# EAGLE design musicbox-breakouts-02 (EAGLE 9.6.2)
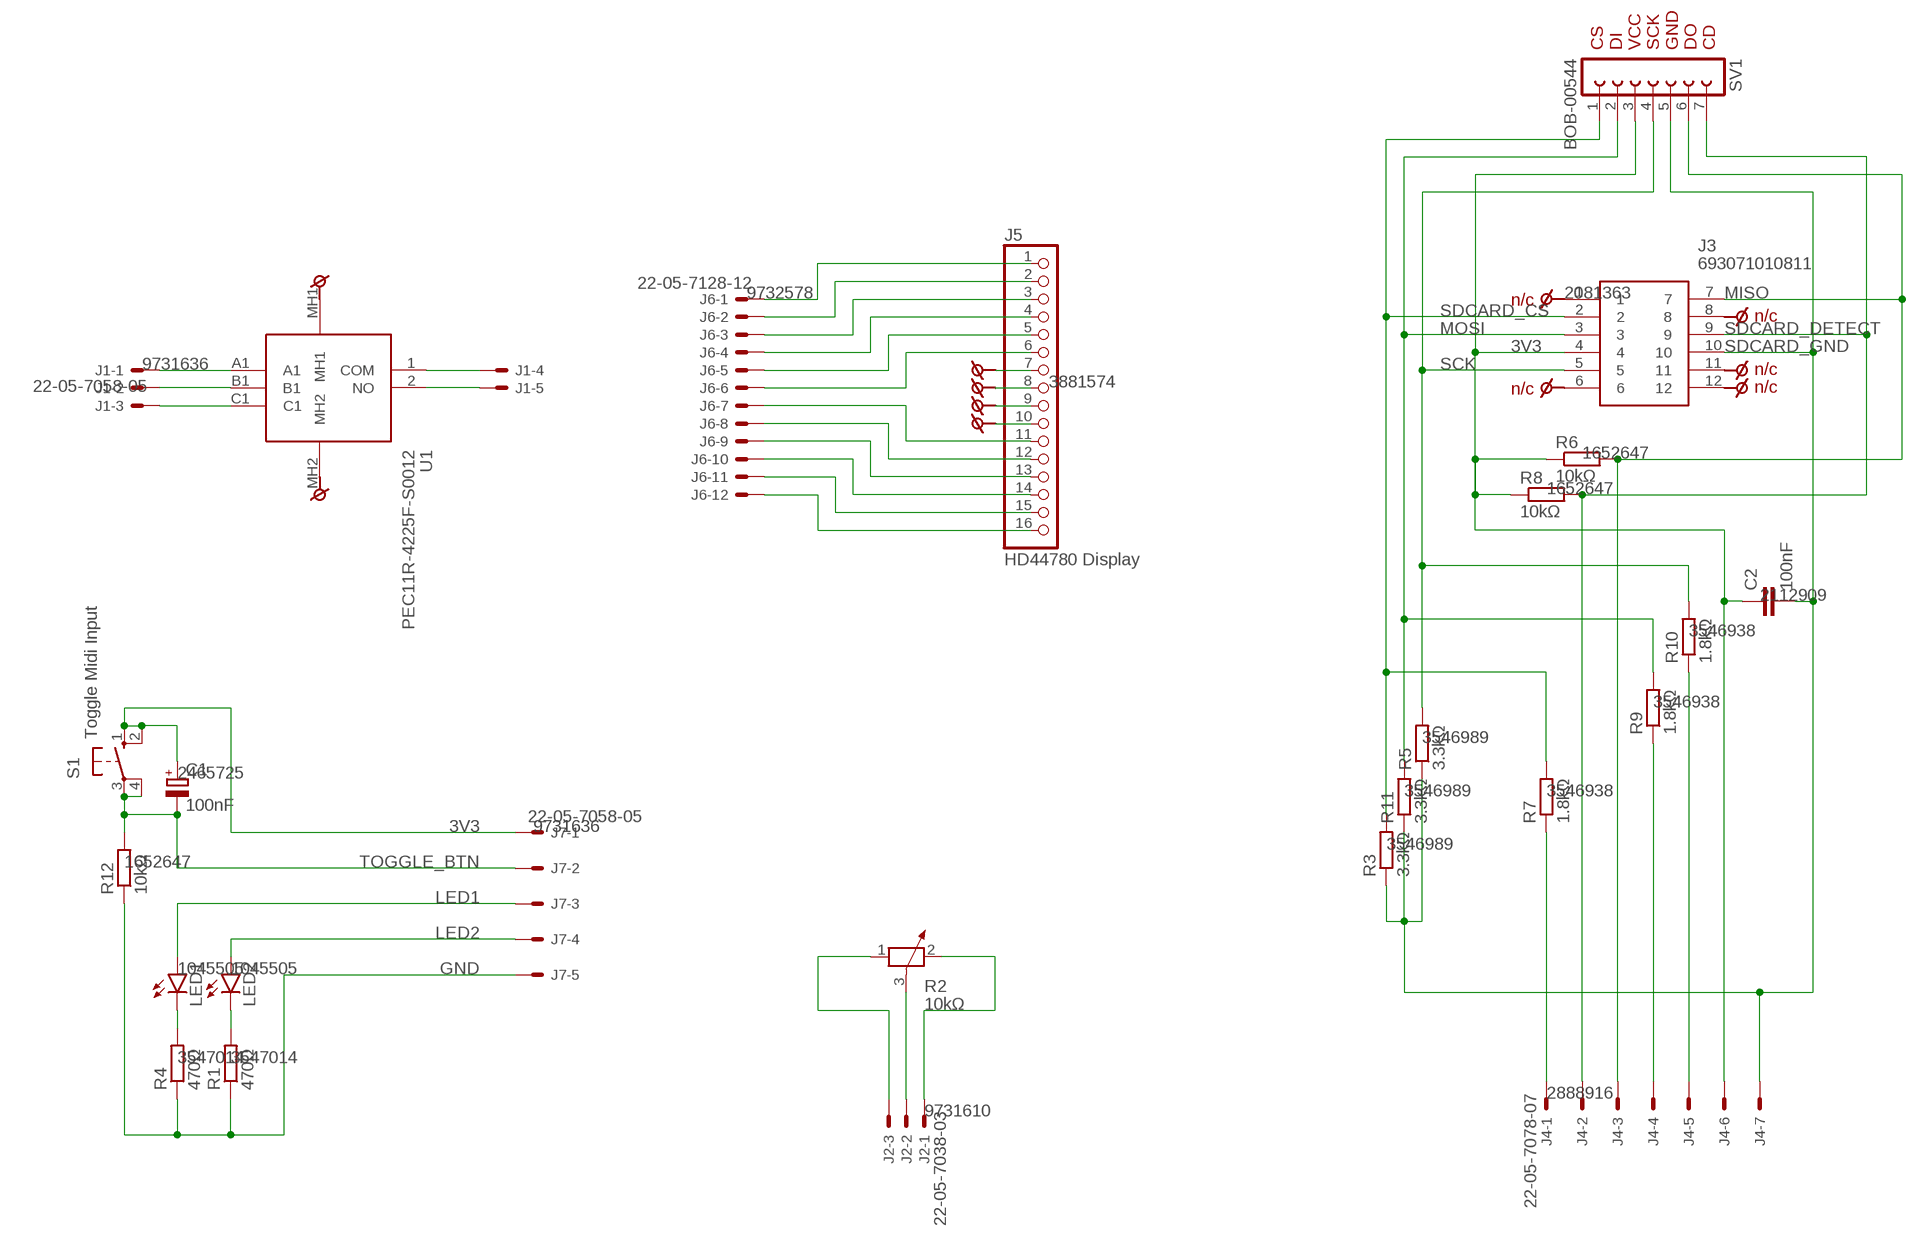
[diagram p0: schematic, sheet 1]

## Parts
C1  100nF  CPOL-EUE1.8-4  [E1,8-4]
C2  100nF  C-EU025-025X050  [C025-025X050]
J1  22-05-7058-05  [7395-05]
J2  22-05-7038-03  [7395-03]
J3  693071010811  [693071010811]
J4  22-05-7078-07  [7395-07]
J5  HD44780 Display  PINHD-1X16  [1X16]
J6  22-05-7128-12  [7395-12]
J7  22-05-7058-05  [7395-05]
LED1  LED3MM  [LED3MM]
LED2  LED3MM  [LED3MM]
R1  470Ω  R-EU_0207/7  [0207/7]
R2  10kΩ  POTENTIOMETER_PT-10  [PT-10]
R3  3.3kΩ  R-EU_0207/7  [0207/7]
R4  470Ω  R-EU_0207/7  [0207/7]
R5  3.3kΩ  R-EU_0207/7  [0207/7]
R6  10kΩ  R-EU_0207/7  [0207/7]
R7  1.8kΩ  R-EU_0207/7  [0207/7]
R8  10kΩ  R-EU_0207/7  [0207/7]
R9  1.8kΩ  R-EU_0207/7  [0207/7]
R10  1.8kΩ  R-EU_0207/7  [0207/7]
R11  3.3kΩ  R-EU_0207/7  [0207/7]
R12  10kΩ  R-EU_0207/7  [0207/7]
S1  Toggle Midi Input  10-XX  [B3F-10XX]
SV1  BOB-00544  FE07-1  [FE07]
U1  PEC11R-4225F-S0012  [PEC11R4225FS0012]
U$1  N/C-ALT  (no package)
U$2  N/C-ALT  (no package)
U$31  N/C-ALT  (no package)
U$32  N/C-ALT  (no package)
U$33  N/C-ALT  (no package)
U$34  N/C-ALT  (no package)
U$68  N/C-ALT-WITH-TEXT  (no package)
U$72  N/C-ALT-WITH-TEXT  (no package)
U$73  N/C-ALT-WITH-TEXT  (no package)
U$74  N/C-ALT-WITH-TEXT  (no package)
U$75  N/C-ALT-WITH-TEXT  (no package)

## Nets
3V3: C2.1 J3.4 J4.6 R6.1 R8.1 SV1.3
DISPLAY_1: J5.1 J6.1
MISO: J3.7 J4.3 R6.2 SV1.6
MOSI: J3.3 R9.2 R11.2 SV1.2
N$1: J1.1 U1.A1
N$2: J1.2 U1.B1
N$3: J1.3 U1.C1
N$4: J1.5 U1.2(NO)
N$5: J1.4 U1.1(COM)
N$6: U1.MH1 U$1.P$1
N$7: U1.MH2 U$2.P$1
N$32: J5.2 J6.2
N$33: J5.3 J6.3
N$34: J5.4 J6.4
N$35: J5.5 J6.5
N$36: J5.6 J6.6
N$37: J5.16 J6.12
N$38: J5.15 J6.11
N$39: J5.14 J6.10
N$40: J5.13 J6.9
N$41: J5.12 J6.8
N$42: J5.11 J6.7
N$43: J5.7 U$31.P$1
N$44: J5.8 U$32.P$1
N$45: J5.9 U$33.P$1
N$46: J5.10 U$34.P$1
N$47: C1.- J7.2 R12.2 S1.3(P) S1.4(P1)
N$48: J7.3 LED1.A
N$49: J7.4 LED2.A
N$52: C1.+ J7.1 S1.1(S) S1.2(S1)
N$53: J7.5 R1.1 R4.1 R12.1
N$54: LED1.K(C) R4.2
N$55: LED2.K(C) R1.2
N$56: J2.3 R2.1
N$57: J2.2 R2.3
N$58: J2.1 R2.2
N$66: J4.1 R7.1
N$67: J3.1 U$68.P$1
N$68: J4.5 R10.1
N$69: J4.4 R9.1
N$70: J3.6 U$72.P$1
N$71: J3.8 U$73.P$1
N$72: J3.11 U$74.P$1
N$73: J3.12 U$75.P$1
SCK: J3.5 R5.2 R10.2 SV1.4
SDCARD_CS: J3.2 R3.2 R7.2 SV1.1
SDCARD_DETECT: J3.9 J4.2 R8.2 SV1.7
SDCARD_GND: C2.2 J3.10 J4.7 R3.1 R5.1 R11.1 SV1.5

## Notes on the sheet
- CS
  DI
  VCC
  SCK
  GND
  DO
  CD
- 3V3
- TOGGLE_BTN
- LED1
- LED2
- GND

## Library data of the parts
C1 = rcl:CPOL-EU: POLARIZED CAPACITOR, European symbol; DIGIKEY_PART_NUMBER: 732-8653-1-ND; FARNELL_PART_NUMBER: 2465725; MANUFACTURER_NAME: Wurth Elektronik; MOUSER_PART_NUMBER: 710-860010672001; SPICEPREFIX: C
C2 = rcl:C-EU: CAPACITOR, European symbol; DIGIKEY_PART_NUMBER: BC5142-ND; FARNELL_PART_NUMBER: 2112909; MANUFACTURER_NAME: Vishay / BC Components; MOUSER_PART_NUMBER: 594-K104M15X7RF53L2; SPICEPREFIX: C
J1 J7 = con-molex:22-?-05: CONNECTOR wire to board 2.54 mm (.1 inch) pitch header; DIGIKEY_PART_NUMBER: WM2787-ND; FARNELL_PART_NUMBER: 9731636; MANUFACTURER_NAME: Molex; MF: MOLEX; MOUSER_PART_NUMBER: 538-22-05-7058; OC_FARNELL: unknown; OC_NEWARK: unknown
J2 = con-molex:22-?-03: CONNECTOR wire to board 2.54 mm (.1 inch) pitch header; DIGIKEY_PART_NUMBER: WM2785-ND; FARNELL_PART_NUMBER: 9731610; MANUFACTURER_NAME: Molex; MF: MOLEX; MOUSER_PART_NUMBER: 538-22-05-7038; OC_FARNELL: unknown; OC_NEWARK: unknown
J3 = 693071010811:693071010811: Wurth Elektronik Micro SD Memory Card Connector Source: Datasheet <https://www.we-online.de/katalog/datasheet/693071010811.pdf>; DESCRIPTION: Wurth Elektronik Micro SD Memory Card Connector; DIGIKEY_PART_NUMBER: 732-3819-1-ND; FARNELL_PART_NUMBER: 2081363; HEIGHT: 2.13mm; MANUFACTURER_NAME: Wurth Elektronik; MANUFACTURER_PART_NUMBER: 693071010811; MOUSER_PART_NUMBER: 710-693071010811; MOUSER_PRICE-STOCK: https://www.mouser.co.uk/ProductDetail/Wurth-Elektronik/693071010811?qs=7gQLVZk5cPniDgiow3734g%3D%3D
J4 = con-molex:22-?-07: CONNECTOR wire to board 2.54 mm (.1 inch) pitch header; DIGIKEY_PART_NUMBER: WM17054-ND; FARNELL_PART_NUMBER: 2888916; MANUFACTURER_NAME: Molex; MF: MOLEX; MOUSER_PART_NUMBER: 538-22-05-7078; OC_FARNELL: unknown; OC_NEWARK: unknown
J5 = pinhead:PINHD-1X16: PIN HEADER; DIGIKEY_PART_NUMBER: 68002-116-ND; FARNELL_PART_NUMBER: 3881574; MANUFACTURER_NAME: Amphenol FCI; MOUSER_PART_NUMBER: 649-1012937891601BLF
J6 = con-molex:22-?-12: CONNECTOR wire to board 2.54 mm (.1 inch) pitch header; DIGIKEY_PART_NUMBER: WM4378-ND; FARNELL_PART_NUMBER: 9732578; MANUFACTURER_NAME: Molex; MF: MOLEX; MOUSER_PART_NUMBER: 538-22-05-7128; OC_FARNELL: unknown; OC_NEWARK: unknown
LED1 LED2 = led:LED: LED OSRAM: - CHIPLED LG R971, LG N971, LY N971, LG Q971, LY Q971, LO R971, LY R971 LH N974, LH R974 LS Q976, LO Q976, LY Q976 LO Q996 - Hyper CHIPLED LW Q18S LB Q993, LB Q99A, LB R99A - SideLED LS A670, LO A670, LY A670, LG A670, LP A670 LB A673, LV A673, LT A673, LW A673 LH A674 LY A675 LS A676, LA A676, LO A676, LY A676, LW A676 LS A679, LY A679, LG A679 - Hyper Micro SIDELED® LS Y876, LA Y876, LO Y876, LY Y876 LT Y87S - SmartLED LW L88C, LW L88S LB L89C, LB L89S, LG L890 LS L89K, LO L89K, LY L89K LS L896, LA L896, LO L896, LY L896 - TOPLED LS T670, LO T670, LY T670, LG T670, LP T670 LSG T670, LSP T670, LSY T670, LOP T670, LYG T670 LG T671, LOG T671, LSG T671 LB T673, LV T673, LT T673, LW T673 LH T674 LS T676, LA T676, LO T676, LY T676, LB T676, LH T676, LSB T676, LW T676 LB T67C, LV T67C, LT T67C, LS T67K, LO T67K, LY T67K, LW E67C LS E67B, LA E67B, LO E67B, LY E67B, LB E67C, LV E67C, LT E67C LW T67C LS T679, LY T679, LG T679 LS T770, LO T770, LY T770, LG T770, LP T770 LB T773, LV T773, LT T773, LW T773 LH T774 LS E675, LA E675, LY E675, LS T675 LS T776, LA T776, LO T776, LY T776, LB T776 LHGB T686 LT T68C, LB T68C - Hyper Mini TOPLED® LB M676 - Mini TOPLED Santana® LG M470 LS M47K, LO M47K, LY M47K Source: http://www.osram.convergy.de LUXEON: - LUMILED® LXK2-PW12-R00, LXK2-PW12-S00, LXK2-PW14-U00, LXK2-PW14-V00 LXK2-PM12-R00, LXK2-PM12-S00, LXK2-PM14-U00 LXK2-PE12-Q00, LXK2-PE12-R00, LXK2-PE12-S00, LXK2-PE14-T00, LXK2-PE14-U00 LXK2-PB12-K00, LXK2-PB12-L00, LXK2-PB12-M00, LXK2-PB14-N00, LXK2-PB14-P00, LXK2-PB14-Q00 LXK2-PR12-L00, LXK2-PR12-M00, LXK2-PR14-Q00, LXK2-PR14-R00 LXK2-PD12-Q00, LXK2-PD12-R00, LXK2-PD12-S00 LXK2-PH12-R00, LXK2-PH12-S00 LXK2-PL12-P00, LXK2-PL12-Q00, LXK2-PL12-R00 Source: www.luxeon.com KINGBRIGHT: KA-3528ASYC Source: www.kingbright.com; DIGIKEY_PART_NUMBER: TLLG4401-AS12CT-ND; FARNELL_PART_NUMBER: 1045505; MANUFACTURER_NAME: Vishay Semiconductors; MOUSER_PART_NUMBER: 78-TLLG4401-AS12
R1 R4 = rcl:R-EU_: RESISTOR, European symbol; DIGIKEY_PART_NUMBER: BC3790CT-ND; FARNELL_PART_NUMBER: 3547014; MANUFACTURER_NAME: Vishay / Beyschlag; MOUSER_PART_NUMBER: 594-MBB02070C4700FCT; SPICEPREFIX: R
R2 = rcl:POTENTIOMETER_: Potentiometer; DIGIKEY_PART_NUMBER: 1993-PT10MV10-103A1010-PM-S-ND; MANUFACTURER_NAME: Amphenol Piher; MOUSER_PART_NUMBER: 531-PT10MV1103A11PMS; SPICEMODEL: POT; SPICEPREFIX: X
R3 R5 R11 = rcl:R-EU_: RESISTOR, European symbol; DIGIKEY_PART_NUMBER: BC3743CT-ND; FARNELL_PART_NUMBER: 3546989; MANUFACTURER_NAME: Vishay / Beyschlag; MOUSER_PART_NUMBER: 594-MBB02070C3301FCT; SPICEPREFIX: R
R6 R8 R12 = rcl:R-EU_: RESISTOR, European symbol; DIGIKEY_PART_NUMBER: BC3569CT-ND; FARNELL_PART_NUMBER: 1652647; MANUFACTURER_NAME: Vishay / Beyschlag; MOUSER_PART_NUMBER: 594-MBB02070C1002FCT; SPICEPREFIX: R
R7 R9 R10 = rcl:R-EU_: RESISTOR, European symbol; DIGIKEY_PART_NUMBER: BC3638CT-ND; FARNELL_PART_NUMBER: 3546938; MANUFACTURER_NAME: Vishay / Beyschlag; MOUSER_PART_NUMBER: 594-MBB02070C1801FCT; SPICEPREFIX: R
S1 = switch-omron:10-XX: OMRON SWITCH; DESCRIPTION: Tactile Switch; DIGIKEY_PART_NUMBER: 2223-TS02-66-130-BK-160-LCR-D-ND; MANUFACTURER_NAME: CUI Devices; MOUSER_PART_NUMBER: 179-TS0266130BK160LC; MPN: B3F-1000; OC_FARNELL: 176432; OC_NEWARK: 36M3542; PACKAGE: 6x6x13mm
SV1 = con-lsta:FE07-1: FEMALE HEADER; OC_FARNELL: unknown; OC_NEWARK: unknown
U1 = PEC11R-4225F-S0012:PEC11R-4225F-S0012: Encoders 25mm SHAFT w/SWITCH Source: Datasheet <https://www.bourns.com/docs/product-datasheets/pec11r.pdf?sfvrsn=bb617cbf_11>; DESCRIPTION: Encoders 25mm SHAFT w/SWITCH; DIGIKEY_PART_NUMBER: PEC11R-4225F-S0012-ND; HEIGHT: 31.5mm; MANUFACTURER_NAME: Bourns; MANUFACTURER_PART_NUMBER: PEC11R-4225F-S0012; MOUSER_PART_NUMBER: 652-PEC11R-4225F-S12; MOUSER_PRICE-STOCK: https://www.mouser.co.uk/ProductDetail/Bourns/PEC11R-4225F-S0012?qs=Zq5ylnUbLm4jMN%252BFiPmzDg%3D%3D
U$1 U$2 U$31-U$34 = nc-pin:N/C-ALT: N/C Symbol No Label With Pin-Leg Alternative Symbol; _EXTERNAL_: n/c
U$68 U$72-U$75 = nc-pin:N/C-ALT-WITH-TEXT: N/C Symbol With Label With Pin-Leg Alternative Symbol Slash-Notation; _EXTERNAL_: n/c

## Net classes
0 default: width 0.406 mm
1 pwr: width 0.965 mm, clearance 0.305 mm

## Board
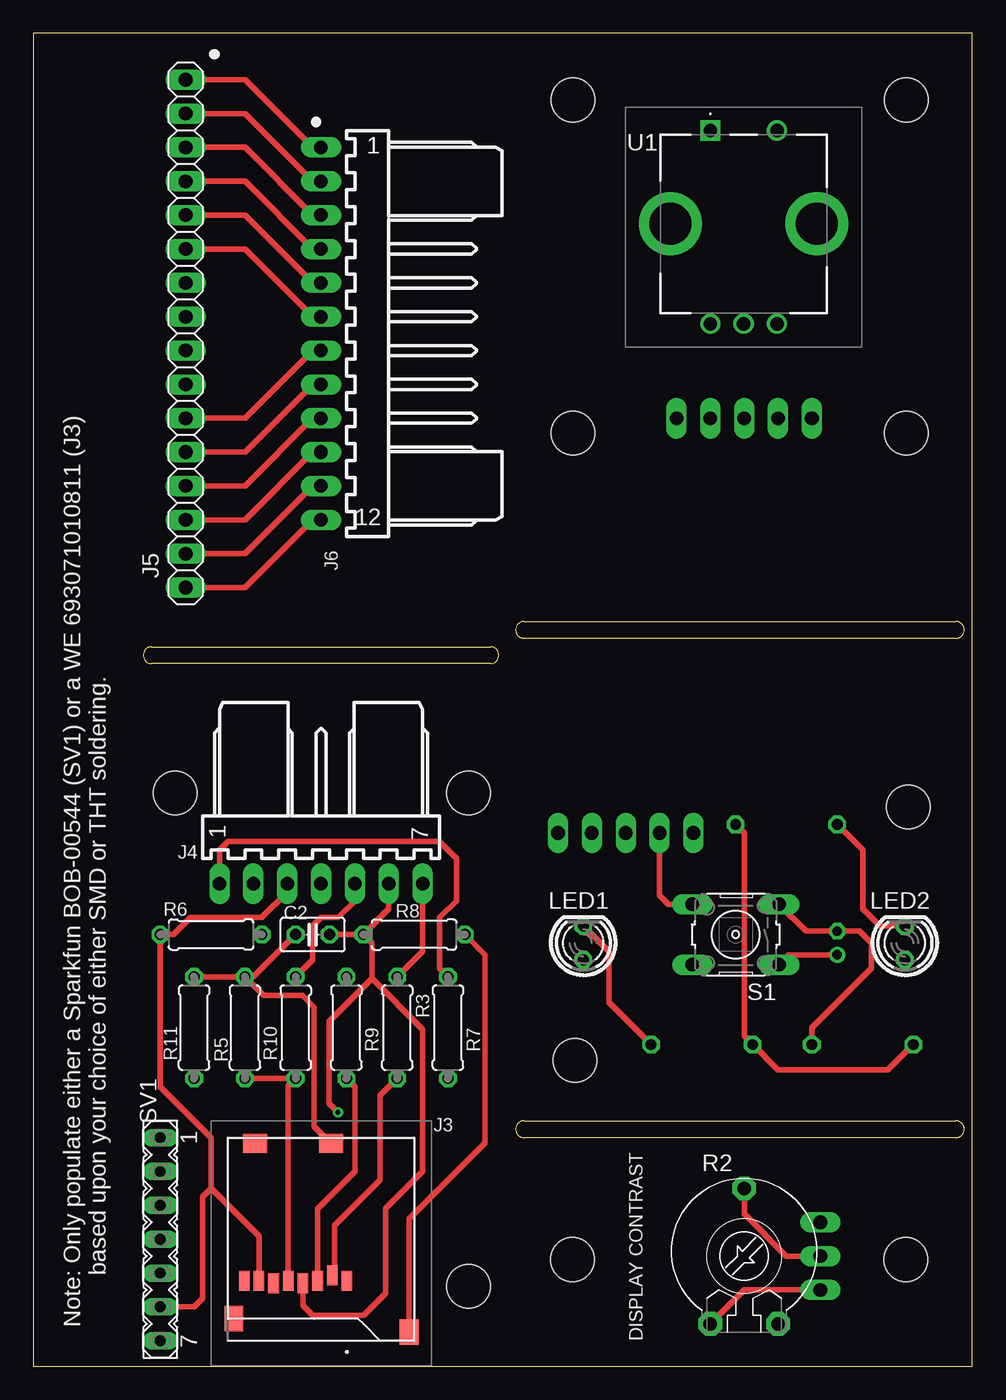
[diagram p1: board, top side]
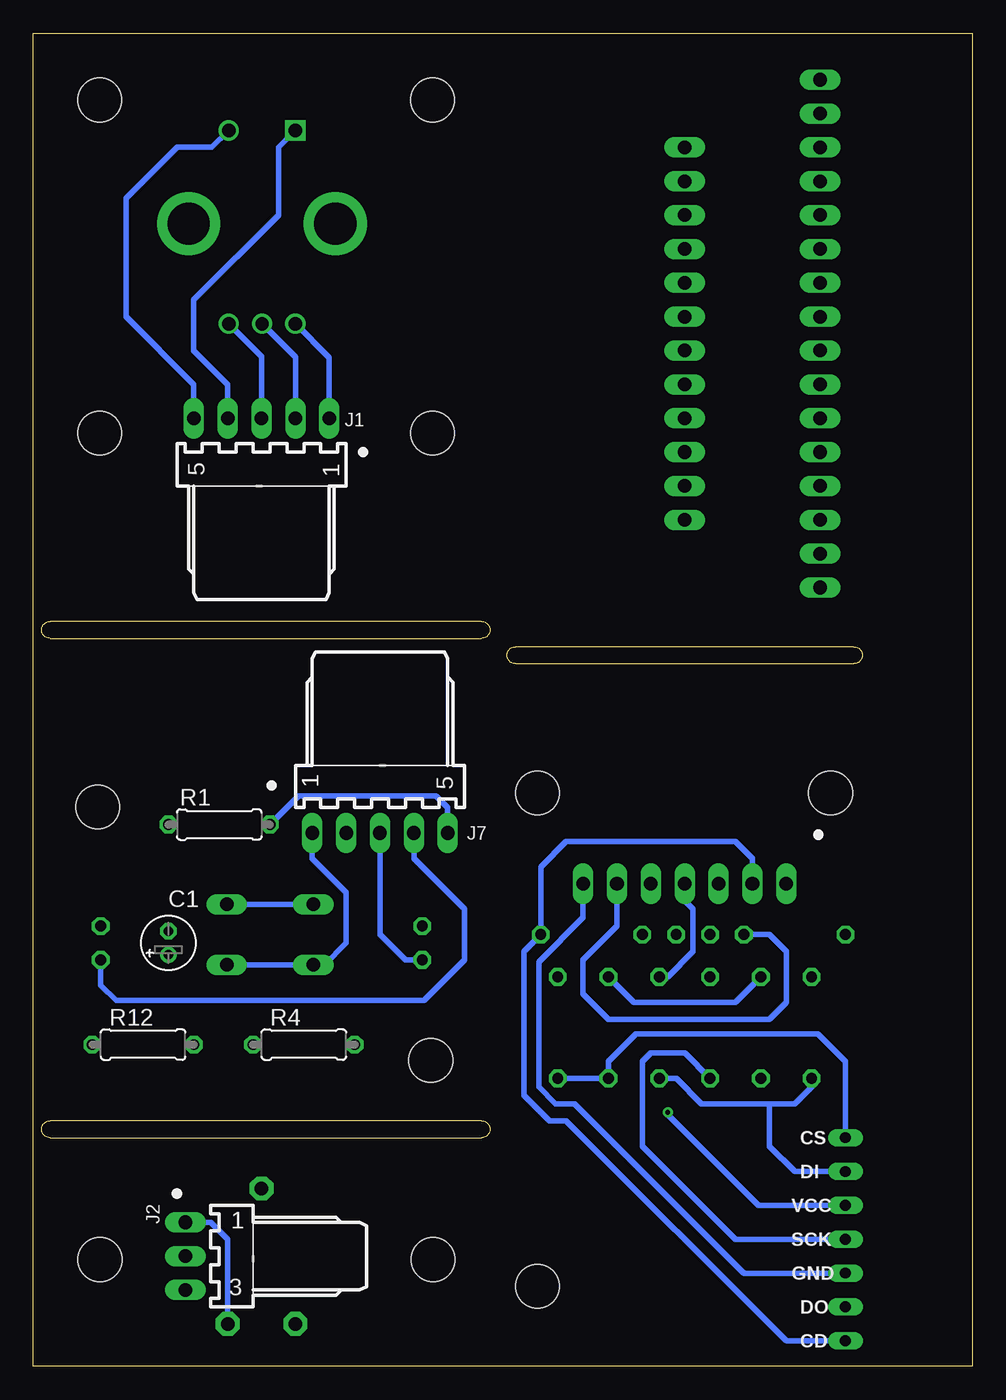
[diagram p2: board, bottom side, seen from below]

Size 70.47 x 100 mm. Coordinates in mm from the lower left corner, seen from the top.
Outline: 0,0 70.47,0 70.47,100 0,100 0,0
Outline: 8.89,53.98 arc180 8.89,52.7 34.29,52.7 arc180 34.29,53.98 8.89,53.98
Outline: 36.83,55.88 arc180 36.83,54.61 69.22,54.61 arc180 69.22,55.88 36.83,55.88
Outline: 36.83,18.41 arc180 36.83,17.14 69.22,17.14 arc180 69.22,18.41 36.83,18.41
Copper layers (1*16): Top 0.035mm / dielectric 1.5mm / Bottom 0.035mm
Design rules "default *": minimum track width 6mil, minimum drill 0.35mm, track to track 28mil, track to pad 12mil, pad to pad 6mil, via to via 6mil, smd to smd 6mil, copper to edge 40mil, drill to drill 6mil, minimum pad ring 10mil, minimum via ring 8mil, stop-mask expansion 4mil, vias tented up to drill 0mil, thermal gap 10mil
Holes 3.28 mm at 65.64,41.95 40.64,22.95 40.47,8 65.47,8 40.5,70 40.5,95 65.5,70 65.5,95 32.64,6 10.64,43 32.64,43

### Footprints (pad centres in the part's own frame; a part is rotated, then mirrored left to right if it is on the bottom)
E1,8-4 = drill 0.711 pad 1.168: + -0.889,0 | drill 0.711 pad 1.168 octagon: - 0.889,0
C025-025X050 = drill 0.813 octagon: 1 -1.27,0; 2 1.27,0
7395-05 = drill 1.016 long: 1 5.08,0; 2 2.54,0; 3 0,0; 4 -2.54,0; 5 -5.08,0
7395-03 = drill 1.016 long: 1 2.54,0; 2 0,0; 3 -2.54,0
693071010811 = smd 0.8 x 1.5: 1 1.94,-3.1; 2 0.84,-2.7; 3 -0.26,-3.1; 4 -1.36,-3.3; 5 -2.46,-3.1; 6 -3.56,-3.3; 7 -4.66,-3.1; 8 -5.76,-3.1 | smd 1.4 x 1.9: 9 6.6,-6.95; 11 -6.55,-5.95 | smd 1.8 x 1.4: 10 0.75,7.2; 12 -4.95,7.2
7395-07 = drill 1.016 long: 1 7.62,0; 2 5.08,0; 3 2.54,0; 4 0,0; 5 -2.54,0; 6 -5.08,0; 7 -7.62,0
1X16 = drill 1.016 long: 1 -19.05,0; 2 -16.51,0; 3 -13.97,0; 4 -11.43,0; 5 -8.89,0; 6 -6.35,0; 7 -3.81,0; 8 -1.27,0; 9 1.27,0; 10 3.81,0; 11 6.35,0; 12 8.89,0; 13 11.43,0; 14 13.97,0; 15 16.51,0; 16 19.05,0
7395-12 = drill 1.016 long: 1 13.97,0; 2 11.43,0; 3 8.89,0; 4 6.35,0; 5 3.81,0; 6 1.27,0; 7 -1.27,0; 8 -3.81,0; 9 -6.35,0; 10 -8.89,0; 11 -11.43,0; 12 -13.97,0
LED3MM = drill 0.813 octagon: A -1.27,0; K 1.27,0
0207/7 = drill 0.813 octagon: 1 -3.81,0; 2 3.81,0
PT-10 = drill 1.016 pad 1.778 octagon: 1 -2.54,-5.08; 2 2.54,-5.08; 3 0,5.08
B3F-10XX = drill 1.016 long: 1 -3.251,2.261; 2 3.251,2.261; 3 -3.251,-2.261; 4 3.251,-2.261
FE07 = drill 0.813 long: 1 -7.62,0; 2 -5.08,0; 3 -2.54,0; 4 0,0; 5 2.54,0; 6 5.08,0; 7 7.62,0
PEC11R4225FS0012 = drill 1 pad 1.5 square: 1 0,0 | drill 1 pad 1.5: 2 5,0; A1 0,-14.5; B1 2.5,-14.5; C1 5,-14.5 | drill 3.16 pad 4.74: MH1 -3,-7; MH2 8,-7

### Placement (x,y rotation side)
C1  60.33,31.75 90 bottom
C2  20.95,32.38 180 top
J1  53.34,71.12 0 bottom
J2  59.05,8.26 90 bottom
J3  21.59,9.53 0 top
J4  21.59,36.2 180 top
J5  11.43,77.47 270 top
J6  21.59,77.47 90 top
J7  44.45,40.01 180 bottom
LED1  41.27,31.75 90 top
LED2  65.41,31.75 90 top
R1  56.52,40.64 180 bottom
R2  53.34,8.26 0 top
R3  27.3,25.4 270 top
R4  50.16,24.13 0 bottom
R5  15.88,25.4 270 top
R6  13.34,32.38 180 top
R7  31.11,25.4 270 top
R8  28.57,32.38 0 top
R9  23.5,25.4 270 top
R10  19.68,25.4 270 top
R11  12.06,25.4 270 top
R12  62.23,24.13 0 bottom
S1  52.7,32.38 180 top
SV1  9.53,9.53 270 top
U1  50.8,92.71 0 top

### Tracks (layer width: path | path; a pad name or v marks a point on that pad's centre or on a via)
3V3  (via drill 0.35)
  Top 0.406: J3.4 20.23,4.54 20.95,3.81 24.77,3.81 26.44,5.48 26.44,11.83 29.21,14.61 29.21,25.27 25.4,29.08 | R8.1 25.4,31.75 25.4,29.08 | R8.1 26.67,34.29 J4.6 | C2.1 R8.1 | 22.71,19.2 v22.86,19.05 22.2,19.71 22.2,25.88 25.4,29.08
  Bottom 0.406: R6.1 15.24,32.38 13.97,31.11 13.97,27.3 15.24,26.04 27.3,26.04 29.21,27.94 29.21,30.48 26.67,33.02 J4.6 | SV1.3 16.06,12.06 22.86,18.87 v22.86,19.05
DISPLAY_1
  Top 0.406: J6.1 20.95,91.44 15.88,96.52 J5.1
MISO
  Top 0.406: J3.7 16.93,9.74 13.34,13.34 | J4.3 19.05,35.56 17.14,33.66 11.81,33.66 10.54,32.38 R6.2 9.53,20.95 13.34,17.14 13.34,13.34 | SV1.6 12.06,4.45 12.7,5.08 12.7,12.7 13.34,13.34
MOSI
  Top 0.406: J3.3 21.33,11.8 24.13,14.61 24.13,20.95 R9.2
  Bottom 0.406: R9.2 22.23,21.59 20.32,19.68 15.24,19.68 | 15.24,19.68 13.34,19.68 12.06,20.95 R11.2 | SV1.2 13.34,14.61 15.24,16.51 15.24,19.68
N$1
  Bottom 0.406: J1.1 48.26,75.67 U1.A1
N$2
  Bottom 0.406: J1.2 50.8,75.71 U1.B1
N$3
  Bottom 0.406: J1.3 53.34,75.75 U1.C1
N$4
  Bottom 0.406: J1.5 58.42,73.66 63.5,78.74 63.5,87.63 59.69,91.44 57.07,91.44 U1.2
N$5
  Bottom 0.406: J1.4 55.88,73.66 58.42,76.2 58.42,80.01 52.07,86.36 52.07,91.44 U1.1
N$32
  Top 0.406: J6.2 20.95,88.9 15.88,93.98 J5.2
N$33
  Top 0.406: J6.3 20.95,86.36 15.88,91.44 J5.3
N$34
  Top 0.406: J6.4 20.95,83.82 15.88,88.9 J5.4
N$35
  Top 0.406: J6.5 20.95,81.28 15.88,86.36 J5.5
N$36
  Top 0.406: J6.6 20.95,78.74 15.88,83.82 J5.6
N$37
  Top 0.406: J6.12 20.95,63.5 15.88,58.42 J5.16
N$38
  Top 0.406: J6.11 20.95,66.04 15.88,60.96 J5.15
N$39
  Top 0.406: J6.10 20.95,68.58 15.88,63.5 J5.14
N$40
  Top 0.406: J6.9 20.95,71.12 15.88,66.04 J5.13
N$41
  Top 0.406: J6.8 20.95,73.66 15.88,68.58 J5.12
N$42
  Top 0.406: J6.7 20.95,76.2 15.88,71.12 J5.11
N$47
  Top 0.406: S1.3 57.96,32.64 C1.- 61.98,32.64 62.87,31.75 62.87,29.84 58.42,25.4 R12.2 | S1.4 47.65,34.65 46.99,35.31 J7.2
  Bottom 0.406: S1.4 S1.3
N$48
  Bottom 0.406: LED1.A 42.55,30.48 44.45,32.38 J7.3
N$49
  Bottom 0.406: LED2.A 65.41,28.57 64.26,27.43 41.15,27.43 38.1,30.48 38.1,34.29 41.91,38.1 J7.4
N$52
  Top 0.406: S1.1 56.69,30.86 C1.+
  Bottom 0.406: S1.2 49.53,30.12 | 49.53,30.12 S1.1 | J7.1 49.53,38.1 46.99,35.56 46.99,31.75 48.62,30.12 49.53,30.12
N$53
  Top 0.406: R12.1 64.14,22.23 55.88,22.23 R4.1 53.34,24.77 53.34,40.01 R1.1
  Bottom 0.406: R1.1 50.55,42.8 40.26,42.8 39.37,41.91 J7.5
N$54
  Top 0.406: R4.2 43.18,27.3 43.18,31.11 LED1.K
N$55
  Top 0.406: LED2.K 63.5,33.02 62.23,34.29 62.23,38.73 R1.2
N$56
  Top 0.406: J2.3 53.34,5.71 R2.1
N$57
  Top 0.406: J2.2 56.52,8.26 53.34,11.43 R2.3
N$58
  Bottom 0.406: R2.2 55.88,9.53 57.15,10.79 J2.1
N$66
  Top 0.406: J4.1 13.97,38.73 14.61,39.37 30.48,39.37 31.75,38.1 31.75,34.92 30.48,33.66 30.48,29.84 R7.1
N$68
  Top 0.406: R10.1 20.95,30.48 20.95,33.02 21.59,33.66 22.86,33.66 24.13,34.92 J4.5
N$69
  Bottom 0.406: R9.1 22.86,29.21 20.95,31.11 20.95,34.29 21.59,34.92 J4.4
SCK
  Top 0.406: J3.5 19.13,21.04 R10.2 R5.2
  Bottom 0.406: SV1.4 17.78,9.53 24.77,16.51 24.77,22.86 24.13,23.5 21.59,23.5 R10.2
SDCARD_CS
  Top 0.406: R3.2 26.04,20.32 26.04,13.97 22.62,10.56 22.62,7.02 J3.2
  Bottom 0.406: R7.2 R3.2 27.3,22.86 25.25,24.92 11.58,24.92 9.53,22.86 SV1.1
SDCARD_DETECT
  Top 0.406: J3.9 28.19,11.04 33.91,16.76 33.91,30.86 R8.2
  Bottom 0.406: J4.2 16.51,38.1 17.78,39.37 30.48,39.37 32.38,37.47 R8.2 33.66,31.11 33.66,20.32 31.75,18.41 30.48,18.41 13.97,1.91 SV1.7
SDCARD_GND
  Top 0.406: J3.10 21.08,17.98 21.08,26.92 20.19,27.81 17.27,27.81 R5.1 | R11.1 R5.1 | R5.1 16.51,29.21 C2.2 | R3.1 29.21,31.11 J4.7
  Bottom 0.406: R3.1 25.4,27.3 17.78,27.3 R5.1 | SV1.5 17.14,6.99 29.84,19.68 31.27,19.68 32.54,20.95 32.54,30.33 29.21,33.66 J4.7

### Text on the board
tNames: Note: Only populate either a Sparkfun BOB-00544 (SV1) or a WE 693071010811 (J3) / based upon your choice of either SMD or THT soldering. | DISPLAY CONTRAST
bNames: CS | DI | VCC | SCK | GND | DO | CD
VScore: V-Cut | V-Cut